# Altium schematic sheet 1.1.6_Interface_board_Pressure&GNSS&IMU.SchDoc
size A4; SheetNumber: 8; SheetTotal: 13
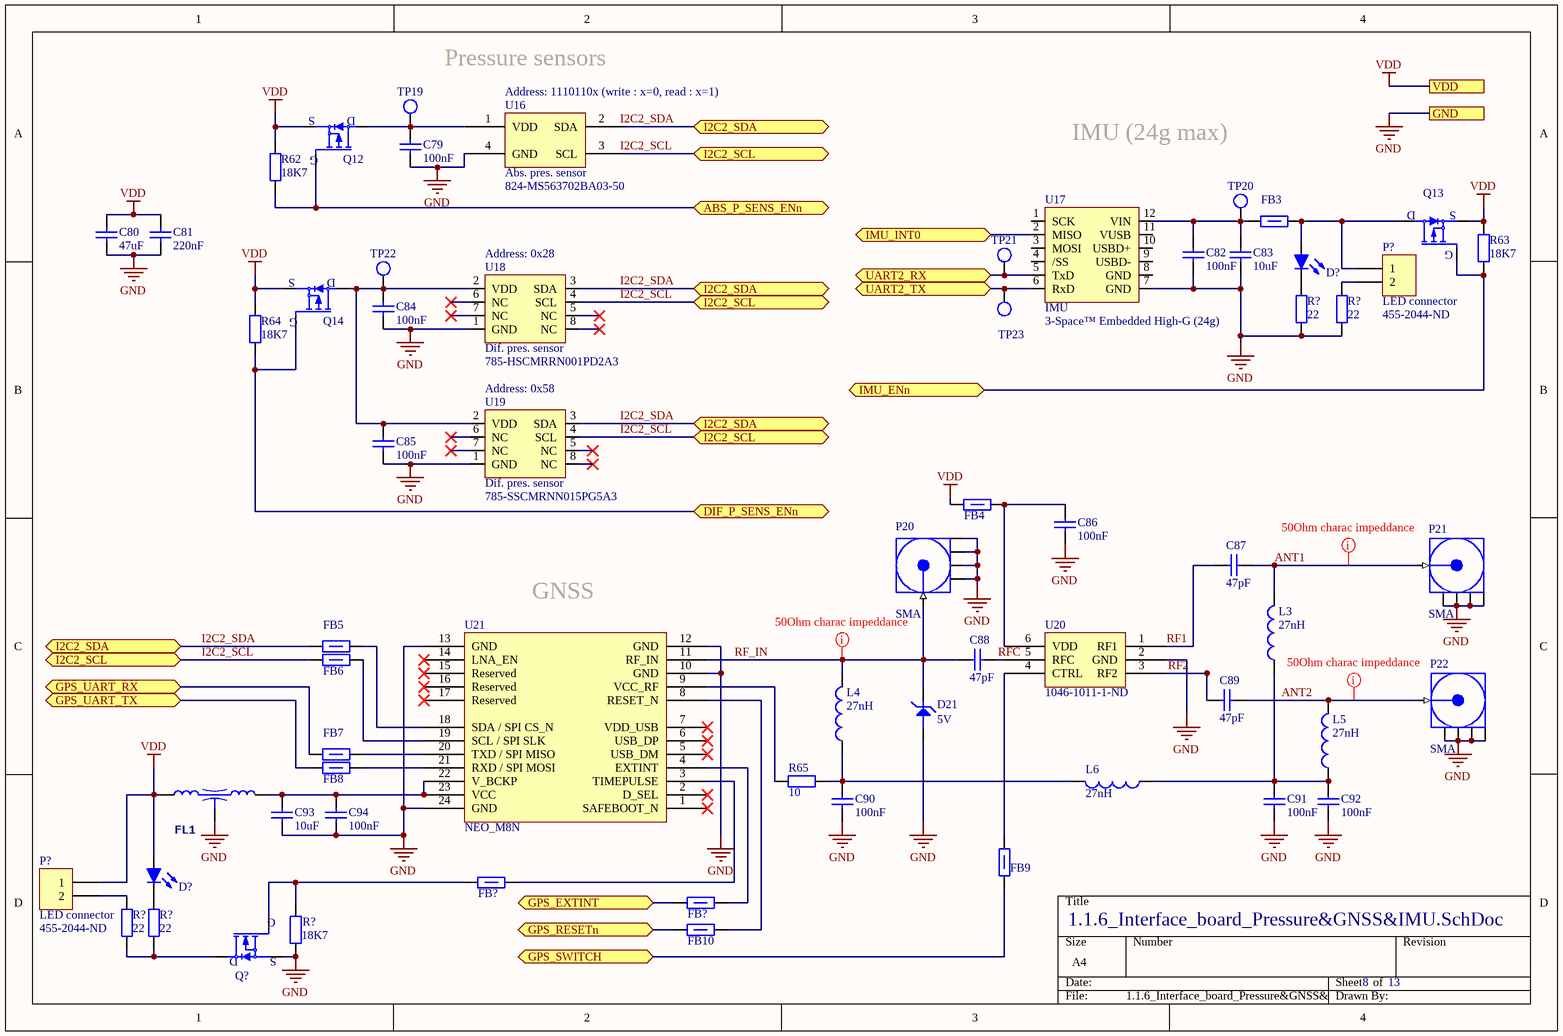
[diagram p0: 1.1.6_Interface_board_Pressure&GNSS&IMU.SchDoc]

## Parts
(Parts that share a designator on the sheet are numbered #1, #2 ... from top to bottom, then left to right.)
C79  100nF  [CAP0603R]
C80  47uF  [CAP1206W]
C81  220nF  [CAP0603R]
C82  100nF  [CAP0603R]
C83  10uF  [CAP0805W]
C84  100nF  [CAP0603R]
C85  100nF  [CAP0603R]
C86  100nF  [CAP0603R]
C87  47pF  [CAP0603R]
C88  47pF  [CAP0603R]
C89  47pF  [CAP0603R]
C90  100nF  [CAP0603R]
C91  100nF  [CAP0603R]
C92  100nF  [CAP0603R]
C93  10uF  [CAP0805W]
C94  100nF  [CAP0603R]
D21  5V  [SOD-923]
D?#1  LED  [WL-SMCW]  (value not drawn)
D?#2  LED  [WL-SMCW]  (value not drawn)
FB3  81-BLM18KG601SZ1D  [0603]  (value not drawn)
FB4  81-BLM18KG601SZ1D  [0603]  (value not drawn)
FB5  81-BLM18KG601SZ1D  [0603]  (value not drawn)
FB6  81-BLM18KG601SZ1D  [0603]  (value not drawn)
FB7  81-BLM18KG601SZ1D  [0603]  (value not drawn)
FB8  81-BLM18KG601SZ1D  [0603]  (value not drawn)
FB9  81-BLM18KG601SZ1D  [0603]  (value not drawn)
FB10  81-BLM18KG601SZ1D  [0603]  (value not drawn)
FB?#1  81-BLM18KG601SZ1D  [0603]  (value not drawn)
FB?#2  81-BLM18KG601SZ1D  [0603]  (value not drawn)
FL1  NFE31P Series (1206 Size)   Chip EMIFILr LC Combined Type  [LCL_NFE31P]  (value not drawn)
L3  27nH  [0603]
L4  27nH  [0603]
L5  27nH  [0603]
L6  27nH  [0603]
P20  SMA  [SMA_TH_VERTICAL_LONG]
P21  SMA  [SMA_TH_VERTICAL_LONG]
P22  SMA  [SMA_TH_VERTICAL_LONG]
P?#1  LED connector  Supplier Part Number 1: 455-2044-ND  [CON_JST_XA_ S02B-XASS-1]
P?#2  LED connector  Supplier Part Number 1: 455-2044-ND  [CON_JST_XA_ S02B-XASS-1]
Q12  MOSFET_P  [SOT23]  (value not drawn)
Q13  MOSFET_P  [SOT23]  (value not drawn)
Q14  MOSFET_P  [SOT23]  (value not drawn)
Q?  MOSFET_N  [SOT-323-3]  (value not drawn)
R62  18K7  [0603]
R63  18K7  [0603]
R64  18K7  [0603]
R65  10  [0603]
R?#1  22  [0603]
R?#2  22  [0603]
R?#3  18K7  [0603]
R?#4  22  [0603]
R?#5  22  [0603]
TP19  Test point  [TP]  (value not drawn)
TP20  Test point  [TP]  (value not drawn)
TP21  Test point  [TP]  (value not drawn)
TP22  Test point  [TP]  (value not drawn)
TP23  Test point  [TP]  (value not drawn)
U16  Abs. pres. sensor  Supplier Part Number 1: 824-MS563702BA03-50  [SMD_3.0X3.0MM_4P]
U17  IMU  Supplier Part Number 1: 3-Space™ Embedded High-G (24g)  [Yost Labs 3-Spac Embedded]
U18  Dif. pres. sensor  Supplier Part Number 1: 785-HSCMRRN001PD2A3  [HSCMRRN060PDSA3]
U19  Dif. pres. sensor  Supplier Part Number 1: 785-SSCMRNN015PG5A3  [HSCMRRN060PDSA3]
U20  Supplier Part Number 1: 1046-1011-1-ND  [SC-70]  (hidden comment: PE4259)
U21  Supplier Part Number 1: NEO_M8N  [NEO-8]  (hidden comment: NEO_M8)

## Ports
ABS_P_SENS_ENn (bidir), DIF_P_SENS_ENn (bidir), GND, GPS_EXTINT (bidir), GPS_RESETn (bidir), GPS_SWITCH (bidir), GPS_UART_RX (bidir), GPS_UART_TX (bidir), I2C2_SCL (bidir), I2C2_SDA (bidir), IMU_ENn (bidir), IMU_INT0 (bidir), UART2_RX (bidir), UART2_TX (bidir), VDD

## Nets
GND: C79.1 C80.1 C81.1 C82.1 C83.1 C84.1 C85.1 C86.1 C90.1 C91.1 C92.1 C93.1 C94.1 D21.2 FL1.2 P20.2 P20.3 P20.4 P20.5 P21.2 P21.3 P21.4 P21.5 P22.2 P22.3 P22.4 P22.5 Q?.2(S) R?#1.1 R?#2.1 R?#3.2 U16.4(GND) U17.7(GND) U18.1(GND) U19.1(GND) U20.2(GND) U21.10(GND) U21.12(GND) U21.13(GND) U21.24(GND) ; port GND
VDD: C80.2 C81.2 D?#2.A FB4.2 FL1.1 P?#2.1 Q12.2(S) Q13.2(S) Q14.2(S) R62.2 R63.2 R64.2 ; port VDD
ABS_P_SENS_ENn: Q12.1(G) R62.1 ; port ABS_P_SENS_ENn
ANT1: C87.1 L3.2 P21.1
ANT2: C89.1 L5.2 P22.1
DIF_P_SENS_ENn: Q14.1(G) R64.1 ; port DIF_P_SENS_ENn
GPS_EXTINT: FB?#2.2 ; port GPS_EXTINT
GPS_RESETn: FB10.2 ; port GPS_RESETn
GPS_SWITCH: FB9.1 ; port GPS_SWITCH
GPS_UART_RX: FB7.1 ; port GPS_UART_RX
GPS_UART_TX: FB8.1 ; port GPS_UART_TX
I2C2_SCL: FB6.1 U16.3(SCL) U18.4(SCL) U19.4(SCL) ; port I2C2_SCL
I2C2_SDA: FB5.1 U16.2(SDA) U18.3(SDA) U19.3(SDA) ; port I2C2_SDA
IMU_ENn: Q13.1(G) R63.1 ; port IMU_ENn
IMU_INT0: U17.2(MISO) ; port IMU_INT0
RF1: C87.2 U20.1(RF1)
RF2: C89.2 U20.3(RF2)
RF_IN: C88.2 D21.1 L4.2 P20.1 U21.11(RF_IN)
RFC: C88.1 U20.5(RFC)
UART2_RX: TP21.1 U17.5(TxD) ; port UART2_RX
UART2_TX: TP23.1 U17.6(RxD) ; port UART2_TX
NetC79_2: C79.2 Q12.3(D) TP19.1 U16.1(VDD)
NetC82_2: C82.2 C83.2 FB3.1 TP20.1 U17.12(VIN)
NetC84_2: C84.2 C85.2 Q14.3(D) TP22.1 U18.2(VDD) U19.2(VDD)
NetC86_2: C86.2 FB4.1 U20.6(VDD)
NetC90_2: C90.2 L4.1 L6.2 R65.2
NetC91_2: C91.2 C92.2 L3.1 L5.1 L6.1
NetC93_2: C93.2 C94.2 FL1.3 U21.22(V_BCKP) U21.23(VCC)
NetD?#1_A: D?#1.A FB3.2 P?#1.1 Q13.3(D)
NetD?#1_C: D?#1.C R?#1.2
NetD?#2_C: D?#2.C R?#5.2
NetFB5_2: FB5.2 U21.18(SDA_/_SPI_CS_N)
NetFB6_2: FB6.2 U21.19(SCL_/_SPI_SLK)
NetFB7_2: FB7.2 U21.20(TXD_/_SPI_MISO)
NetFB8_2: FB8.2 U21.21(RXD_/_SPI_MOSI)
NetFB9_2: FB9.2 U20.4(CTRL)
NetFB10_1: FB10.1 U21.8(RESET_N)
NetFB?#1_1: FB?#1.1 U21.3(TIMEPULSE)
NetFB?#1_2: FB?#1.2 Q?.1(G) R?#3.1
NetFB?#2_1: FB?#2.1 U21.4(EXTINT)
NetP?#1_2: P?#1.2 R?#2.2
NetP?#2_2: P?#2.2 R?#4.2
NetQ?_3: Q?.3(D) R?#4.1 R?#5.1
NetR65_1: R65.1 U21.9(VCC_RF)

Not connected (* = marked no-connect by the designer): U17 1(SCK) 3(MOSI) 4(/SS) 8(GND) 9(USBD-) 10(USBD+) 11(VUSB); U18 5(NC)* 6(NC)* 7(NC)* 8(NC)*; U19 5(NC)* 6(NC)* 7(NC)* 8(NC)*; U21 1(SAFEBOOT_N)* 2(D_SEL)* 5(USB_DM)* 6(USB_DP)* 7(VDD_USB)* 14(LNA_EN)* 15(Reserved)* 16(Reserved)* 17(Reserved)*

## Layout directives
rule Undefined: ANT1, ANT2, RF_IN

## Notes on the sheet
- Pressure sensors
- (near U16) Address: 1110110x (write : x=0, read : x=1)
- IMU (24g max)
- (near U18) Address: 0x28
- (near U19) Address: 0x58
- (near U21) GNSS
- Labels drawn without touching a wire or pin: I2C2_SCL, I2C2_SDA

## Library data of the parts
C79 C82 C84-C86 C90-C92 C94 = C_100nF: Capacitor; Supplier 1: Mouser; Supplier Part Number 1: 81-GCG188R91H104KA1D
C80 = C_47uF_25v_1206: Capacitor; Supplier 1: Mouser; Supplier Part Number 1: 810-C3216X5R1E476M
C81 = C_220nF: Capacitor; Supplier 1: Mouser; Supplier Part Number 1: 81-GCG188R91H224KA1D
C83 C93 = C_10uF_16v: Capacitor; Supplier 1: Mouser; Supplier Part Number 1: 81-GRT21BC81C106ME1L
C87-C89 = C_47pF_25V: Capacitor; Supplier 1: Mouser; Supplier Part Number 1: 77-VJ0603A470JXXPBC
D21 = ESD9L5.0ST5G: Diodes TVS - Parasurtenseurs ESD; Supplier 1: Mouser; Supplier Part Number 1: 863-ESD9L5.0ST5G
D?#1 D?#2 = LED_SMD_GREEN_0603: Standard LEDs - SMD WL-SMCW Waterclr 0603 Green; Supplier 1: Mouser; Supplier Part Number 1: 710-150060GS75000
FB3-FB10 FB?#1 FB?#2 = Ferrite_bead: Supplier 1: Mouser; Supplier Part Number 1: 81-BLM18KG601SZ1D
FL1 = NFE31P: Supplier 1: Mouser; Supplier Part Number 1: 81-NFE31PT222Z1E9L
L3-L6 = L_27nH: Inductor; Supplier 1: Mouser; Supplier Part Number 1: 81-LQG18HN27NJ00D
P20-P22 = COAX_SMA_PCB: Connecteurs coaxiaux SMA STRAIGHT JACK PCB MOUNT BULKHEAD; Supplier 1: Mouser; Supplier Part Number 1: 523-132291
P?#1 P?#2 = Header 2p JST XA 3A right angle: Supplier 1: Digi-Key
Q12-Q14 = MOSFET_P_ 20V_1.5A: MOSFET 40V P-channel Trench MOSFET SOT-23-3; Supplier 1: Mouser; Supplier Part Number 1: 771-PMV250EPEAR
Q? = MOSFET_N_ 20V_1.4A: MOSFET N-Ch 20V 1.4A SOT-323-3; Supplier 1: Mouser; Supplier Part Number 1: 726-SP000917562
R62-R64 R?#3 = R_0603_01W_18K7: 0.1W 18K7; Supplier 1: Mouser; Supplier Part Number 1: 667-ERJ-3EKF1872V
R65 = R_0603_025W_10Ohm: 0.25W 10Ohm; Supplier 1: Mouser; Supplier Part Number 1: 667-ERJ-PA3J100V
R?#1 R?#2 R?#4 R?#5 = R_0603_025W_22Ohm: 0.25W 22Ohm; LatestRevisionDate: 17-Jul-2002; LatestRevisionNote: Re-released for DXP Platform.; PackageReference: AXIAL-0.4; PackageDescription: Axial Device, Thru-Hole; 2 Leads; 0.4 in Pin Spacing; Supplier 1: Mouser; Supplier Part Number 1: 667-ERJ-PA3J220V
U16 = MS563702BA03-50: Pressure sensor; Supplier 1: Mouser
U17 = YostLab_3-Space_Embedded: Supplier 1: Yost Labs
U18 = HSCMRRN001PD2A3: Diff pressure sensor 1 psi; Supplier 1: Mouser
U19 = SSCMRNN015PG5A3: Diff pressure sensor 0 psi to 15 psi; Supplier 1: Mouser
U20 = PE4259: RF SWITCH; Supplier 1: Digi-Key
U21 = uBlox_Neo M8: GNSS; Supplier 1: uBlox